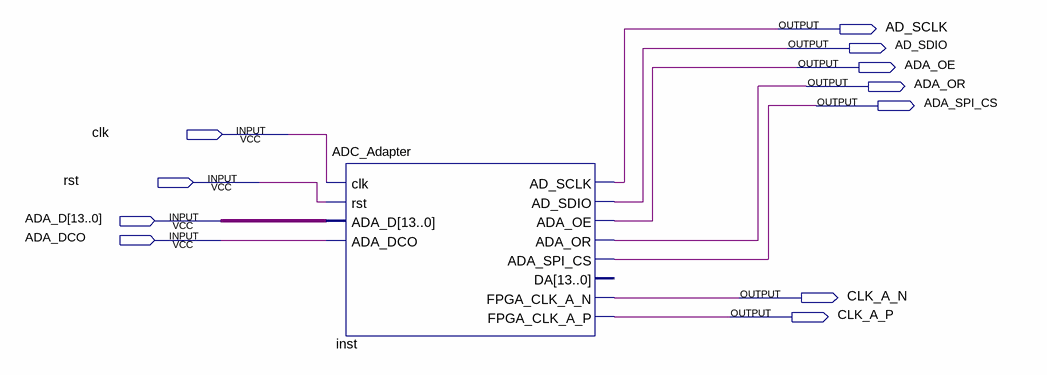
[diagram p0: schematic sheet]
// Quartus schematic adc_test.bdf as structural Verilog: 1 symbols, 11 pins
module adc_test (
  input  clk,
  input  rst,
  input  [13:0] ADA_D,
  input  ADA_DCO,
  output AD_SCLK,
  output AD_SDIO,
  output ADA_OE,
  output ADA_OR,
  output ADA_SPI_CS,
  output CLK_A_N,
  output CLK_A_P
);

  ADC_Adapter inst (
    .clk(clk), .rst(rst), .ADA_D(ADA_D), .ADA_DCO(ADA_DCO), .AD_SCLK(AD_SCLK), .AD_SDIO(AD_SDIO),
    .ADA_OE(ADA_OE), .ADA_OR(ADA_OR), .ADA_SPI_CS(ADA_SPI_CS), .FPGA_CLK_A_N(CLK_A_N), .FPGA_CLK_A_P(CLK_A_P));  // open: DA
endmodule
